# EAGLE design pong (EAGLE 4.16)
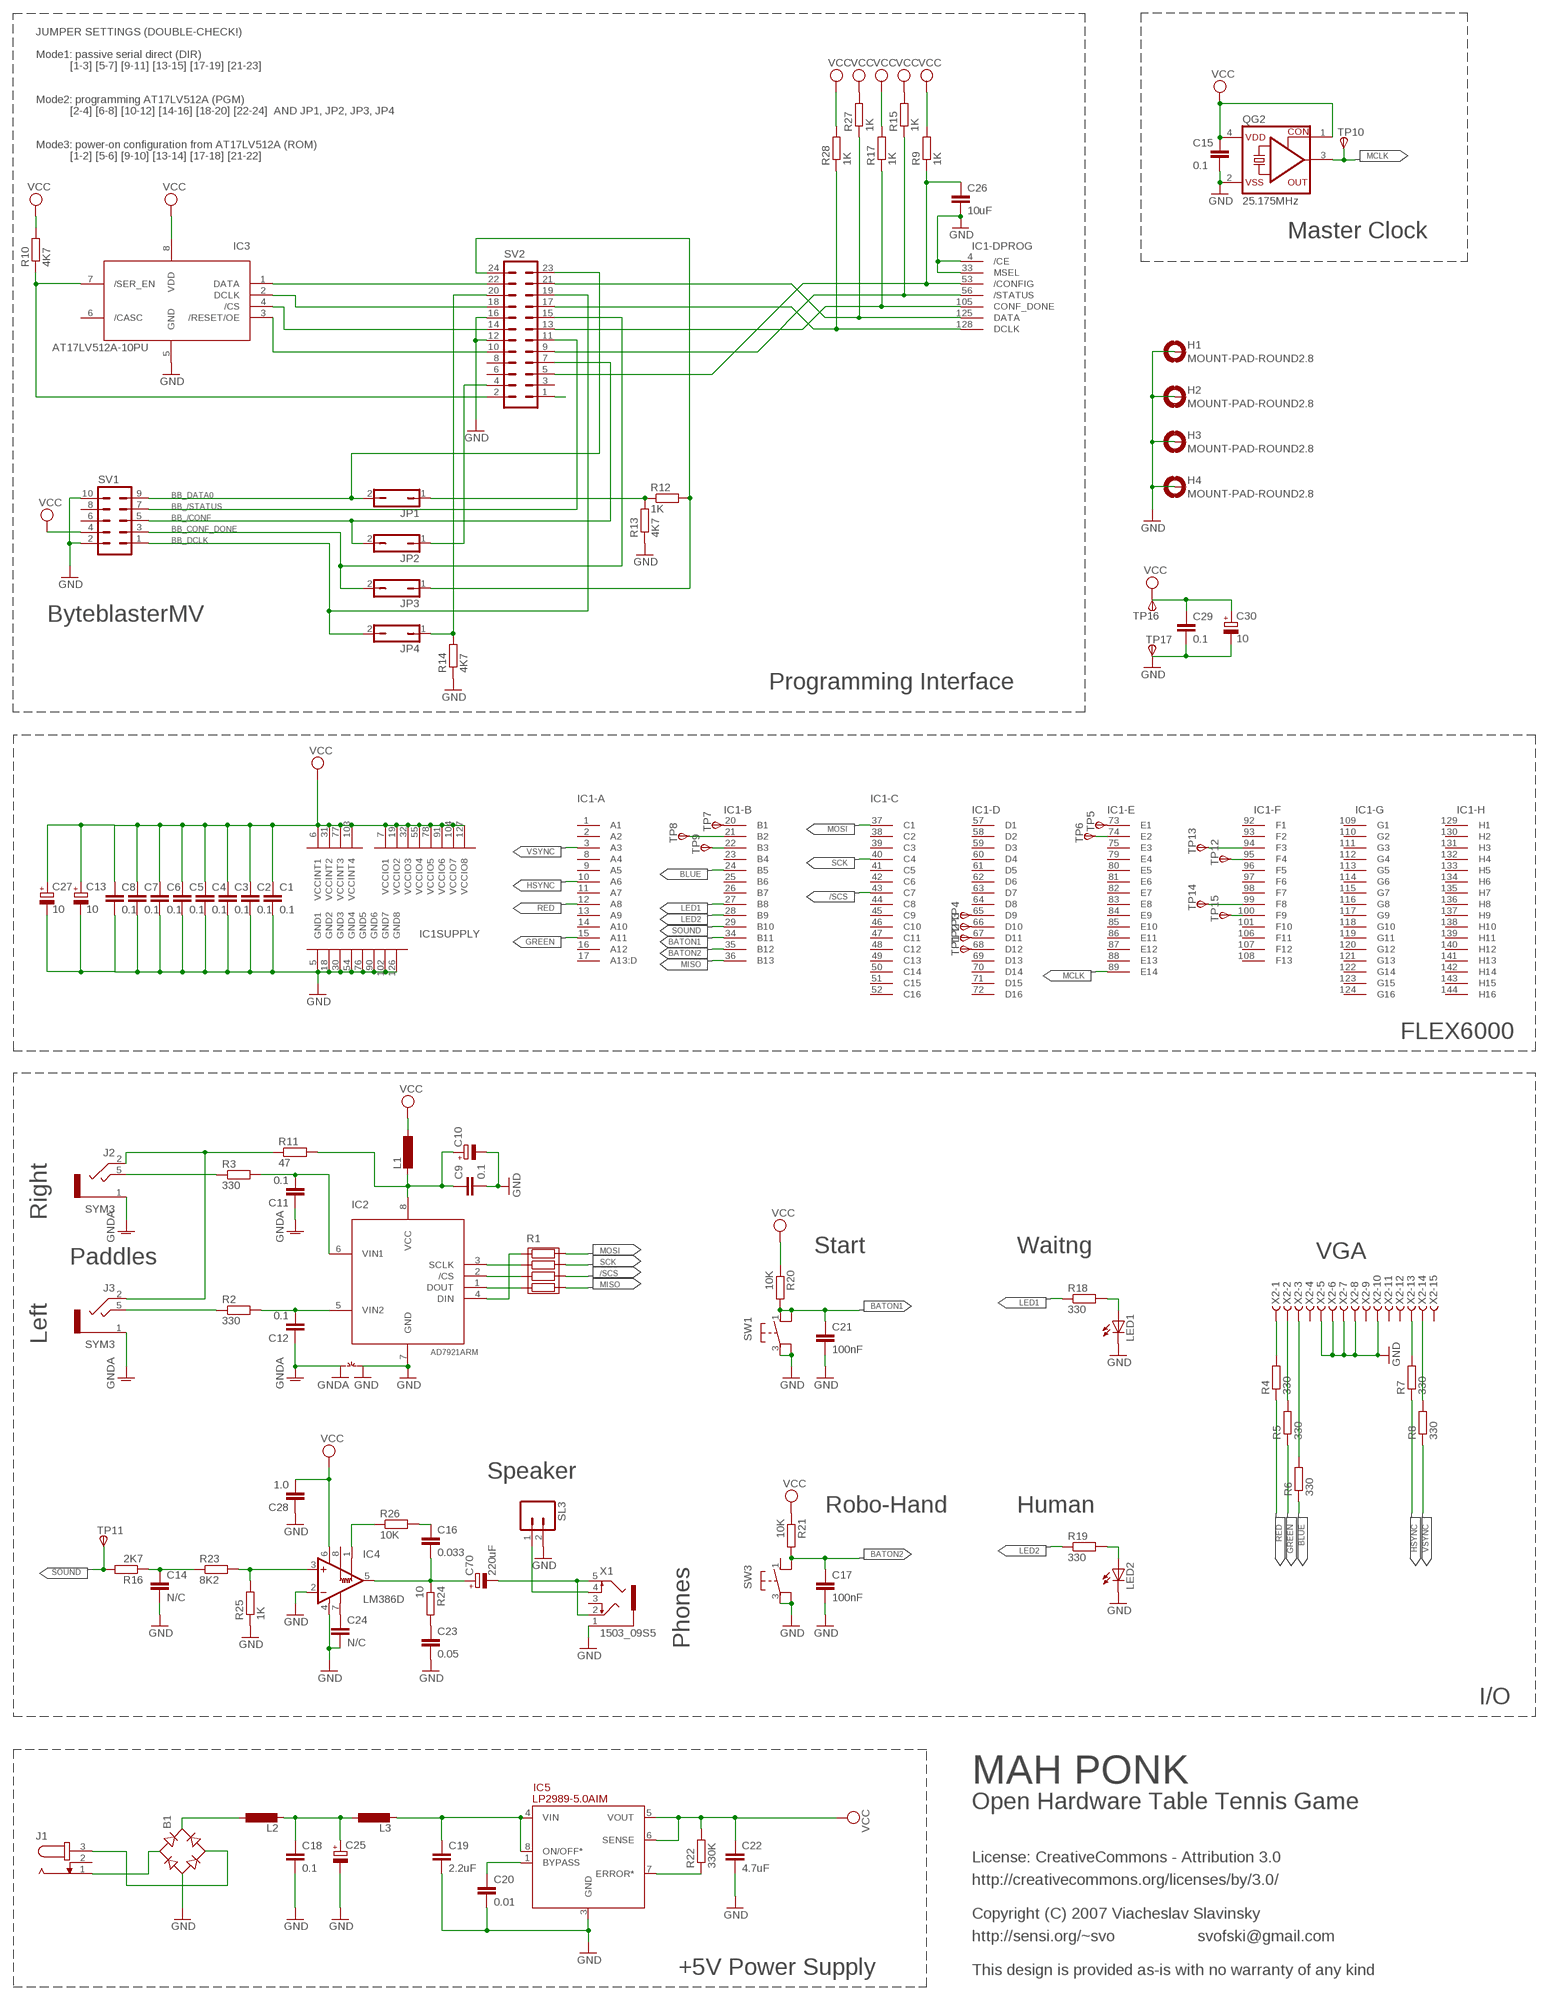
[diagram p0: schematic, sheet 1]

## Parts
B1  B-DIL  [B-DIL]
C1  0.1  C-EUC0603  [C0603]
C2  0.1  C-EUC0603  [C0603]
C3  0.1  C-EUC0603  [C0603]
C4  0.1  C-EUC0603  [C0603]
C5  0.1  C-EUC0603  [C0603]
C6  0.1  C-EUC0603  [C0603]
C7  0.1  C-EUC0603  [C0603]
C8  0.1  C-EUC0603  [C0603]
C9  0.1  C-EUC0603  [C0603]
C10  CPOL-EUB/3528-21R  [B/3528-21R]
C11  0.1  C-EUC0603  [C0603]
C12  0.1  C-EUC0603  [C0603]
C13  10  CPOL-EUB/3528-21R  [B/3528-21R]
C14  N/C  C-EUC0805S  [C0805S]
C15  0.1  C-EUC0603  [C0603]
C16  0.033  C-EUC0805S  [C0805S]
C17  100nF  C-EUC0805S  [C0805S]
C18  0.1  C-EUC0805S  [C0805S]
C19  2.2uF  C-EUC0805S  [C0805S]
C20  0.01  C-EUC0603  [C0603]
C21  100nF  C-EUC0805S  [C0805S]
C22  4.7uF  C-EUC0805S  [C0805S]
C23  0.05  C-EUC0805S  [C0805S]
C24  N/C  C-EUC0603  [C0603]
C25  CPOL-EUC  [PANASONIC_C]
C26  10uF  C-EUC0805S  [C0805S]
C27  10  CPOL-EUB/3528-21R  [B/3528-21R]
C28  1.0  C-EUC0805S  [C0805S]
C29  0.1  C-EUC0603  [C0603]
C30  10  CPOL-EUB/3528-21R  [B/3528-21R]
C70  220uF  CPOL-EUE2.5-5  [E2,5-5]
H1  MOUNT-PAD-ROUND2.8  [2,8-PAD]
H2  MOUNT-PAD-ROUND2.8  [2,8-PAD]
H3  MOUNT-PAD-ROUND2.8  [2,8-PAD]
H4  MOUNT-PAD-ROUND2.8  [2,8-PAD]
IC1  EPF6016TC144  [TQFP144]
IC2  AD7921ARM  AD7922ARM  [MSOP8]
IC3  AT17LV512A-10PU  [DIL08]
IC4  LM386D  [LINEAR_SO08]
IC5  LP2989-5.0AIM  [SO-08]
J1  JACK-PLUG0  [SPC4077]
J2  SYM3  [SYMMETRON3]
J3  SYM3  [SYMMETRON3]
JP1  JP1Q  [JP1]
JP2  JP1Q  [JP1]
JP3  JP1Q  [JP1]
JP4  JP1Q  [JP1]
L1  L-EU0805  [R0805-SVO]
L2  L-EUL5650M  [L5650M]
L3  L-EUL5650M  [L5650M]
LED1  LED3MM  [LED3MM]
LED2  LED3MM  [LED3MM]
QG2  25.175MHz  KXO-97SMD  [KXO97]
R1  RES4  [RESSMD-YC16]
R2  330  R-EU_R0805S  [R0805-SVO]
R3  330  R-EU_R0805S  [R0805-SVO]
R4  330  R-EU_R0805S  [R0805-SVO]
R5  330  R-EU_R0805S  [R0805-SVO]
R6  330  R-EU_R0805S  [R0805-SVO]
R7  330  R-EU_R0805S  [R0805-SVO]
R8  330  R-EU_R0805S  [R0805-SVO]
R9  1K  R-EU_R0805S  [R0805-SVO]
R10  4K7  R-EU_R0805S  [R0805-SVO]
R11  47  R-EU_R0805S  [R0805-SVO]
R12  1K  R-EU_R0805S  [R0805-SVO]
R13  4K7  R-EU_R0805S  [R0805-SVO]
R14  4K7  R-EU_R0805S  [R0805-SVO]
R15  1K  R-EU_R0805S  [R0805-SVO]
R16  2K7  R-EU_R0805S  [R0805-SVO]
R17  1K  R-EU_R0805S  [R0805-SVO]
R18  330  R-EU_R0805S  [R0805-SVO]
R19  330  R-EU_R0805S  [R0805-SVO]
R20  10K  R-EU_R0805S  [R0805-SVO]
R21  10K  R-EU_R0805S  [R0805-SVO]
R22  330K  R-EU_R0805S  [R0805-SVO]
R23  8K2  R-EU_R0805S  [R0805-SVO]
R24  10  R-EU_R0805S  [R0805-SVO]
R25  1K  R-EU_R0805S  [R0805-SVO]
R26  10K  R-EU_R0805S  [R0805-SVO]
R27  1K  R-EU_R0805S  [R0805-SVO]
R28  1K  R-EU_R0805S  [R0805-SVO]
SL3  M02  [02P]
SV1  ML10  [ML10]
SV2  MA12-2  [MA12-2]
SW1  BUTTON_6X6_THRU  [6X6_BUTTON_THRU]
SW3  BUTTON_6X6_THRU  [6X6_BUTTON_THRU]
TP1  TPSPAD1-13  [P1-13]
TP2  TPSPAD1-13  [P1-13]
TP3  TPSPAD1-13  [P1-13]
TP4  TPSPAD1-13  [P1-13]
TP5  TPSPAD1-13  [P1-13]
TP6  TPSPAD1-13  [P1-13]
TP7  TPSB1,27  [B1,27]
TP8  TPSB1,27  [B1,27]
TP9  TPSB1,27  [B1,27]
TP10  TPSPAD1-13  [P1-13]
TP11  TPSPAD1-13  [P1-13]
TP12  TPSB1,27  [B1,27]
TP13  TPSB1,27  [B1,27]
TP14  TPSB1,27  [B1,27]
TP15  TPSB1,27  [B1,27]
TP16  TPSPAD1-13  [P1-13]
TP17  TPSPAD1-13  [P1-13]
X1  1503_09S5  [SYMMETRON5]
X2  F15HDHS  [HDF15H]
~NUDEV~1  GND-GNDA  [GND-GNDA]

## Nets
/SCS: IC1.43(-C:C7) R1.R3$2(3.2)
ADCVCC: J2.2 J3.2 R11.1
AT17CS: IC3.4(/CS) SV2.14
AT17DATA: IC3.1(DATA) SV2.22
AT17DCLK: IC3.2(DCLK) SV2.18
AT17RESET: IC3.3(/RESET/OE) SV2.10
AT17SEREN: IC3.7(/SER_EN) R10.1 SV2.2
BATON1: C21.1 IC1.34(-B:B11) R20.2 SW1.1(P2) SW1.2
BATON2: C17.1 IC1.35(-B:B12) R21.2 SW3.2
BB_/CONF: JP2.2 SV1.5 SV2.7
BB_/STATUS: SV1.7 SV2.11
BB_CONF_DONE: JP3.2 SV1.3 SV2.15
BB_DATA0: JP1.2 SV1.9 SV2.23
BB_DCLK: JP4.2 SV1.1 SV2.19
BJB_CONF_DONE: JP3.1 R12.2 SV2.24
BJB_DATA_0: JP1.1 R12.1 R13.2
BJB_DCLK: JP4.1 R14.2 SV2.20
BJB_NCONF: JP2.1 SV2.4
BLUE: IC1.24(-B:B5) R6.1
BLUEPIN: R6.2 X2.3
CONF_DONE: IC1.105(-DPROG:CONF_DONE) R17.1 SV2.13
DATA0: IC1.125(-DPROG:DATA) R27.1 SV2.21
DCLK: IC1.128(-DPROG:DCLK) R28.1 SV2.17
GND: B1.- C1.2 C2.2 C3.2 C4.2 C5.2 C6.2 C7.2 C8.2 C9.2 C10.- C13.- C14.2 C15.2 C17.2 C18.2 C19.2 C20.2 C21.2 C22.2 C23.2 C24.2 C25.- C26.2 C27.- C28.1 C29.2 C30.- H1.B2,8(MOUNT) H2.B2,8(MOUNT) H3.B2,8(MOUNT) H4.B2,8(MOUNT) IC1.4(-DPROG:/CE) IC1.5(SUPPLY:GND1) IC1.18(SUPPLY:GND2) IC1.30(SUPPLY:GND3) IC1.33(-DPROG:MSEL) IC1.54(SUPPLY:GND4) IC1.76(SUPPLY:GND5) IC1.90(SUPPLY:GND6) IC1.102(SUPPLY:GND7) IC1.126(SUPPLY:GND8) IC2.7(GND) IC3.5(GND) IC4.2(-IN) IC4.4(GND) IC5.3(GND) LED1.K(C) LED2.K(C) QG2.2(VSS) R13.1 R14.1 R25.1 SL3.2 SV1.2 SV1.10 SV2.12 SV2.16 SW1.3(P1) SW1.4(P1) SW3.3(P1) SW3.4(P1) TP17.1(PP) X1.1 X2.5 X2.6 X2.7 X2.8 X2.10 ~NUDEV~1.GND
GNDA: C11.1 C12.1 J2.1 J3.1 ~NUDEV~1.GNDA
GREEN: IC1.15(-A:A11) R5.1
GREENPIN: R5.2 X2.2
HSYNC: IC1.10(-A:A6) R7.1
HSYNCPIN: R7.2 X2.13
LED1: IC1.27(-B:B8) R18.1
LED2: IC1.28(-B:B9) R19.1
MCLK: IC1.89(-E:E14) QG2.3(OUT) TP10.1(PP)
MISO: IC1.36(-B:B13) R1.R4$2(4.2)
MOSI: IC1.37(-C:C1) R1.R1$2(1.2)
N$1: LED1.A R18.2
N$2: IC2.1(DOUT) R1.R4$1(4.1)
N$3: IC2.2(/CS) R1.R3$1(3.1)
N$4: IC2.3(SCLK) R1.R2$1(2.1)
N$5: IC2.4(DIN) R1.R1$1(1.1)
N$6: C11.2 IC2.6(VIN1) R3.2
N$7: C12.2 IC2.5(VIN2) R2.2
N$8: J2.5 R3.1
N$9: J3.5 R2.1
N$10: IC1.95(-F:F4) TP12.PP
N$11: LED2.A R19.2
N$13: IC1.94(-F:F3) TP13.PP
N$14: IC1.99(-F:F8) TP14.PP
N$15: IC1.100(-F:F9) TP15.PP
N$16: C9.1 C10.+ IC2.8(VCC) L1.2 R11.2
N$18: C19.1 IC5.4(VIN) IC5.8(ON/OFF*) L3.2
N$20: B1.AC2 J1.3
N$21: B1.AC1 J1.1
N$22: SV2.1
N$26: B1.+ L2.1
N$29: C20.1 IC5.1(BYPASS)
N$30: IC5.7(ERROR*) R22.1
N$31: IC4.3(+IN) R23.2 R25.2
N$32: IC4.1(+GAIN) R26.1
N$33: C16.1 R26.2
N$34: C70.- X1.2 X1.5
N$35: C16.2 C70.+ IC4.5(OUT) R24.1
N$36: C23.1 R24.2
N$37: C24.1 IC4.7(BYPASS)
N$38: SL3.1 X1.4
N$39: IC1.65(-D:D9) TP4.1(PP)
N$40: IC1.66(-D:D10) TP3.1(PP)
N$41: IC1.67(-D:D11) TP2.1(PP)
N$42: IC1.68(-D:D12) TP1.1(PP)
N$43: IC1.73(-E:E1) TP5.1(PP)
N$44: IC1.74(-E:E2) TP6.1(PP)
N$45: C14.1 R16.1 R23.1
N$46: IC1.20(-B:B1) TP7.PP
N$47: IC1.21(-B:B2) TP8.PP
N$48: IC1.22(-B:B3) TP9.PP
N$49: C18.1 C25.+ L2.2 L3.1
NCONFIG: C26.1 IC1.53(-DPROG:/CONFIG) R9.1 SV2.5
NSTATUS: IC1.56(-DPROG:/STATUS) R15.1 SV2.9
RED: IC1.12(-A:A8) R4.1
REDPIN: R4.2 X2.1
SCK: IC1.40(-C:C4) R1.R2$2(2.2)
SOUND: IC1.29(-B:B10) R16.2 TP11.1(PP)
VCC: C1.1 C2.1 C3.1 C4.1 C5.1 C6.1 C7.1 C8.1 C13.+ C15.1 C22.1 C27.+ C28.2 C29.1 C30.+ IC1.6(SUPPLY:VCCINT1) IC1.7(SUPPLY:VCCIO1) IC1.19(SUPPLY:VCCIO2) IC1.31(SUPPLY:VCCINT2) IC1.32(SUPPLY:VCCIO3) IC1.55(SUPPLY:VCCIO4) IC1.77(SUPPLY:VCCINT3) IC1.78(SUPPLY:VCCIO5) IC1.91(SUPPLY:VCCIO6) IC1.103(SUPPLY:VCCINT4) IC1.104(SUPPLY:VCCIO7) IC1.127(SUPPLY:VCCIO8) IC3.8(VDD) IC4.6(V+) IC5.5(VOUT) IC5.6(SENSE) L1.1 QG2.1(CON) QG2.4(VDD) R9.2 R10.2 R15.2 R17.2 R20.1 R21.1 R22.2 R27.2 R28.2 SV1.4 TP16.1(PP)
VSYNC: IC1.3(-A:A3) R8.1
VSYNCPIN: R8.2 X2.14
Unconnected: IC1.1(-A:A1) IC1.2(-A:A2) IC1.8(-A:A4) IC1.9(-A:A5) IC1.11(-A:A7) IC1.13(-A:A9) IC1.14(-A:A10) IC1.16(-A:A12) IC1.17(-A:A13:D) IC1.23(-B:B4) IC1.25(-B:B6) IC1.26(-B:B7) IC1.38(-C:C2) IC1.39(-C:C3) IC1.41(-C:C5) IC1.42(-C:C6) IC1.44(-C:C8) IC1.45(-C:C9) IC1.46(-C:C10) IC1.47(-C:C11) IC1.48(-C:C12) IC1.49(-C:C13) IC1.50(-C:C14) IC1.51(-C:C15) IC1.52(-C:C16) IC1.57(-D:D1) IC1.58(-D:D2) IC1.59(-D:D3) IC1.60(-D:D4) IC1.61(-D:D5) IC1.62(-D:D6) IC1.63(-D:D7) IC1.64(-D:D8) IC1.69(-D:D13) IC1.70(-D:D14) IC1.71(-D:D15) IC1.72(-D:D16) IC1.75(-E:E3) IC1.79(-E:E4) IC1.80(-E:E5) IC1.81(-E:E6) IC1.82(-E:E7) IC1.83(-E:E8) IC1.84(-E:E9) IC1.85(-E:E10) IC1.86(-E:E11) IC1.87(-E:E12) IC1.88(-E:E13) IC1.92(-F:F1) IC1.93(-F:F2) IC1.96(-F:F5) IC1.97(-F:F6) IC1.98(-F:F7) IC1.101(-F:F10) IC1.106(-F:F11) IC1.107(-F:F12) IC1.108(-F:F13) IC1.109(-G:G1) IC1.110(-G:G2) IC1.111(-G:G3) IC1.112(-G:G4) IC1.113(-G:G5) IC1.114(-G:G6) IC1.115(-G:G7) IC1.116(-G:G8) IC1.117(-G:G9) IC1.118(-G:G10) IC1.119(-G:G11) IC1.120(-G:G12) IC1.121(-G:G13) IC1.122(-G:G14) IC1.123(-G:G15) IC1.124(-G:G16) IC1.129(-H:H1) IC1.130(-H:H2) IC1.131(-H:H3) IC1.132(-H:H4) IC1.133(-H:H5) IC1.134(-H:H6) IC1.135(-H:H7) IC1.136(-H:H8) IC1.137(-H:H9) IC1.138(-H:H10) IC1.139(-H:H11) IC1.140(-H:H12) IC1.141(-H:H13) IC1.142(-H:H14) IC1.143(-H:H15) IC1.144(-H:H16) IC3.6(/CASC) IC4.8(-GAIN) J1.2 SV1.6 SV1.8 SV2.3 SV2.6 SV2.8 SW3.1(P2) X1.3 X2.4 X2.9 X2.11 X2.12 X2.15

## Notes on the sheet
- JUMPER SETTINGS (DOUBLE-CHECK!)
- Mode1: passive serial direct (DIR)
- [1-3] [5-7] [9-11] [13-15] [17-19] [21-23]
- Mode2: programming AT17LV512A (PGM)
- [2-4] [6-8] [10-12] [14-16] [18-20] [22-24]  AND JP1, JP2, JP3, JP4
- Mode3: power-on configuration from AT17LV512A (ROM)
- [1-2] [5-6] [9-10] [13-14] [17-18] [21-22]
- Master Clock
- ByteblasterMV
- Programming Interface
- FLEX6000
- Right
- VGA
- Start | Waitng
- Paddles
- Left
- Speaker
- Robo-Hand | Human
- Phones
- I/O
- MAH PONK
- Open Hardware Table Tennis Game
- License: CreativeCommons - Attribution 3.0
- http://creativecommons.org/licenses/by/3.0/
- Copyright (C) 2007 Viacheslav Slavinsky
- http://sensi.org/~svo | svofski@gmail.com
- +5V Power Supply | This design is provided as-is with no warranty of any kind

## Library data of the parts
B1 = rectifier:B-DIL: RECTIFIER
C1-C9 C11 C12 C14-C24 C26 C28 C29 = rcl:C-EU: CAPACITOR, European symbol
C10 C13 C25 C27 C30 C70 = rcl:CPOL-EU: POLARIZED CAPACITOR, European symbol
H1-H4 = holes:MOUNT-PAD-ROUND: MOUNTING PAD, round
IC1 = altera:EPF6016TC144: FLEX 6000
IC2 = 0-ad7912,7922:AD7922*: Kickass 2-Channel, 2.35 V to 5.25 V, 1 MSPS, 12-Bit ADC.
IC3 = 0-at17lv:AT17LV512*: FPGA Configuration EEPROM Memory, 512Kbit
IC4 = audioamp:LM386: OP AMP
IC5 = 0-svo-lp2981:LP2989*: Micropower/Low Noise, 500mA Ultra Low-Dropout Regulator for use with Ceramic Output Capacitors
J1 = con-jack:JACK-PLUG: DC POWER JACK Power Jack, DC, Right Angle, Through Hole, Rated 5A at 16VDC, PC Terminals Distributor: Farnell (www.Farnell.de) Drawing: 84N1161.pdf / 84N1162.pdf Manufacturer: SPC Technology (www.spctechnology.com) Type: SPC4077 / SPC 4078
J2 J3 = 0-svo-jacks:SYM3
JP1-JP4 = jumper:JP1Q: JUMPER
L1-L3 = rcl:L-EU: INDUCTOR, European symbol
LED1 LED2 = 0-svo:LED: LED OSRAM: - CHIPLED LG R971, LG N971, LY N971, LG Q971, LY Q971, LO R971, LY R971 LH N974, LH R974 LS Q976, LO Q976, LY Q976 LO Q996 - Hyper CHIPLED LW Q18S LB Q993, LB Q99A, LB R99A - SideLED LS A670, LO A670, LY A670, LG A670, LP A670 LB A673, LV A673, LT A673, LW A673 LH A674 LY A675 LS A676, LA A676, LO A676, LY A676, LW A676 LS A679, LY A679, LG A679 - Hyper Micro SIDELED® LS Y876, LA Y876, LO Y876, LY Y876 LT Y87S - SmartLED LW L88C, LW L88S LB L89C, LB L89S, LG L890 LS L89K, LO L89K, LY L89K LS L896, LA L896, LO L896, LY L896 - TOPLED LS T670, LO T670, LY T670, LG T670, LP T670 LSG T670, LSP T670, LSY T670, LOP T670, LYG T670 LG T671, LOG T671, LSG T671 LB T673, LV T673, LT T673, LW T673 LH T674 LS T676, LA T676, LO T676, LY T676, LB T676, LH T676, LSB T676, LW T676 LB T67C, LV T67C, LT T67C, LS T67K, LO T67K, LY T67K, LW E67C LS E67B, LA E67B, LO E67B, LY E67B, LB E67C, LV E67C, LT E67C LW T67C LS T679, LY T679, LG T679 LS T770, LO T770, LY T770, LG T770, LP T770 LB T773, LV T773, LT T773, LW T773 LH T774 LS E675, LA E675, LY E675, LS T675 LS T776, LA T776, LO T776, LY T776, LB T776 LHGB T686 LT T68C, LB T68C - Hyper Mini TOPLED® LB M676 - Mini TOPLED Santana® LG M470 LS M47K, LO M47K, LY M47K Source: http://www.osram.convergy.de/
QG2 = 0-svo:KXO-97SMD: GEYER Clock Oscillator SMD Version, 5V 1.80 — 50.0MHz Frequency Stability: ±50ppm at -20 — + 70 °C CON pin: Active = +5V/Open
R1 = 0-svo:RES4
R2-R28 = rcl:R-EU_: RESISTOR, European symbol
SL3 = con-amp-quick:M02: AMP QUICK CONNECTOR
SV1 = con-ml:ML10: HARTING
SV2 = con-lstb:MA12-2: PIN HEADER
SW1 SW3 = 0-svo:BUTTON_6X6_*
TP1-TP17 = 0-svo:TPS: TEST PIN
X1 = 0-svo-jacks:1503_09: Jack connectors according to JISC 6560, 3.5 mm Klinkeneinbaukupplung nach JISC 6560, 3,5 mm, 3-polig/ stereo, abgewinkelte Ausführung, mit 2 Öffnern und Lötaugen, für Leiterplatten Rückseitenmontage Source: http://www.lumberg.com/Produkte/PDFs/1503_09.pdf
X2 = con-subd:F15?S: SUB-D
~NUDEV~1 = supply-dummy:GND-GNDA: Example of GND--GNDA NET-Connetor for more info read description in package

## Net classes
0 default: width 0.254 mm

## Board
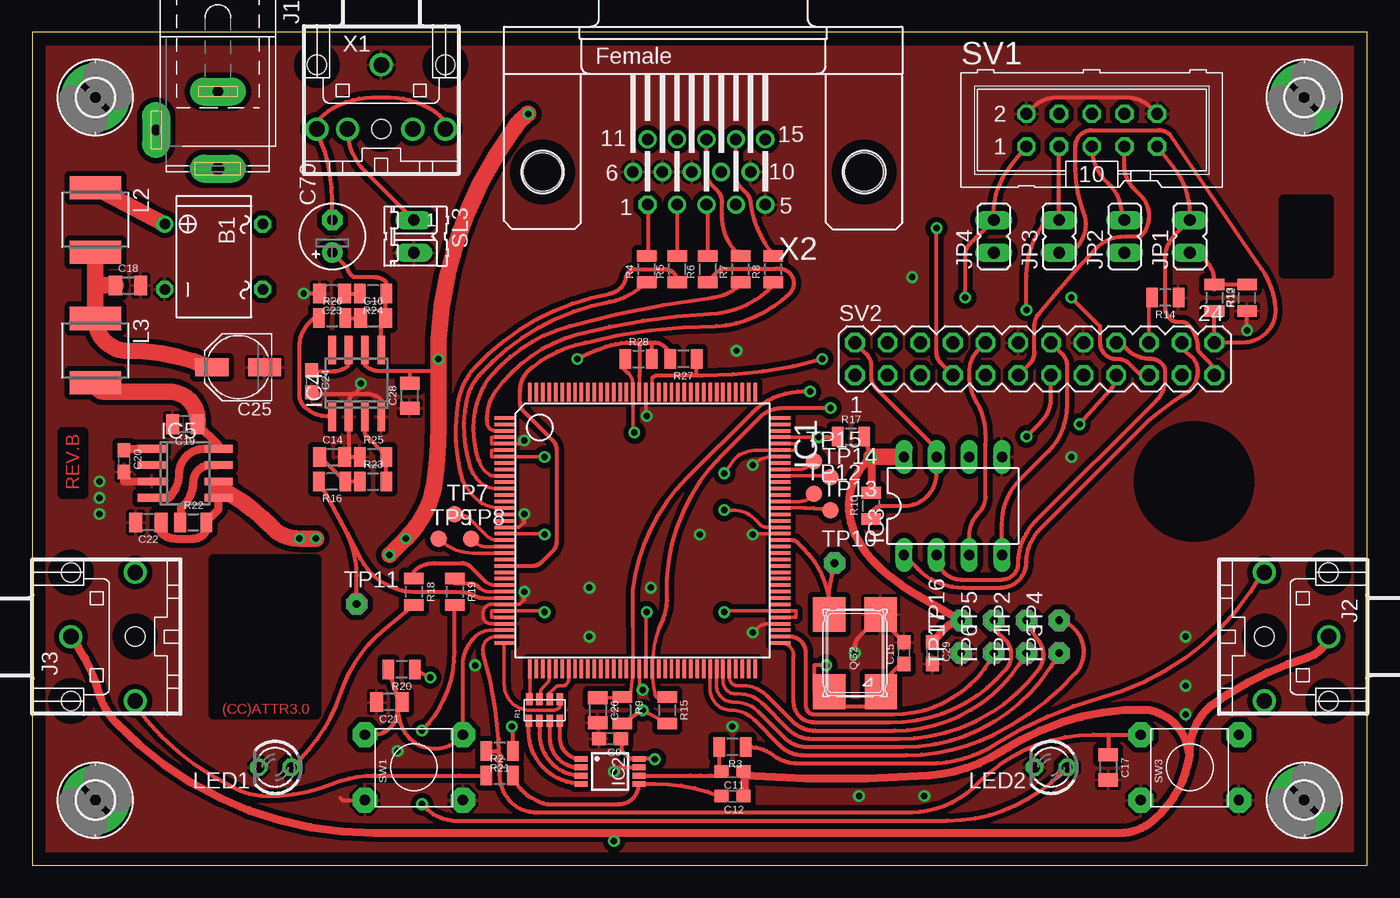
[diagram p1: board, top side]
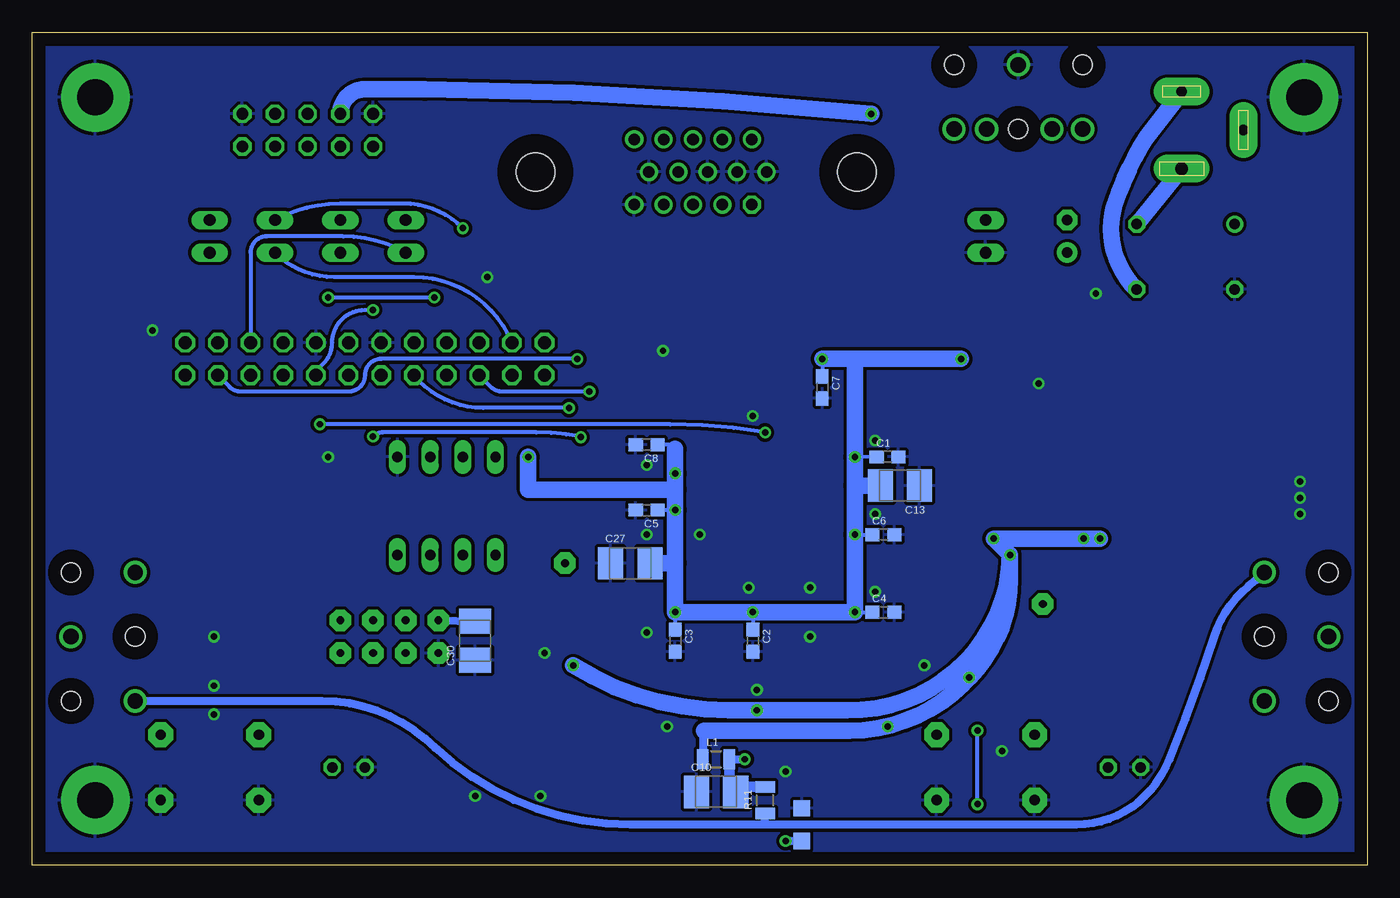
[diagram p2: board, bottom side, seen from below]

Size 103.81 x 64.76 mm. Coordinates in mm from the lower left corner, seen from the top.
Outline: 0,0 103.81,0 103.81,64.76 0,64.76 0,0
Copper layers (1*16): Top 0.035mm / dielectric 1.5mm / Bottom 0.035mm
Design rules "default": minimum track width 0.24mm, minimum drill 0.5mm, track to track 0.24mm, track to pad 0.15mm, pad to pad 0.15mm, via to via 0.24mm, smd to smd 0.15mm, copper to edge 40mil, drill to drill 8mil, minimum pad ring 10mil, minimum via ring 8mil, stop-mask expansion 1mil, vias tented up to drill 0mil, thermal gap 10mil
tRestrict: area 97.3,46 to 100.8,51.7; area 86.2,25.7 to 94.4,34; area 35.7,32.7 to 37,33.3; area 2.4,28.9 to 4,33.6; area 14.1,11.7 to 22.1,23.8

### Footprints (pad centres in the part's own frame; a part is rotated, then mirrored left to right if it is on the bottom)
B-DIL = drill 0.813 round: + -2.54,-3.81 | drill 0.813 octagon: - 2.54,-3.81; AC1 2.54,3.81; AC2 -2.54,3.81
C0603 = smd 1.1 x 1: 1 -0.85,0; 2 0.85,0
B/3528-21R = smd 1.95 x 2.5: + 1.525,0; - -1.525,0
C0805S = smd 1.016 x 1.524: 1 -0.977,0; 2 0.977,0
PANASONIC_C = smd 2.6 x 1.4: + 2.05,0; - -2.05,0
E2,5-5 = drill 0.813 pad 1.6 round: + -1.27,0 | drill 0.813 pad 1.6 octagon: - 1.27,0
2,8-PAD = drill 2.8 pad 5.334 round: B2,8 0,0
TQFP144 = smd 0.27 x 1.5: 1 -8.75,-10.75; 2 -8.25,-10.75; 3 -7.75,-10.75; 4 -7.25,-10.75; 5 -6.75,-10.75; 6 -6.25,-10.75; 7 -5.75,-10.75; 8 -5.25,-10.75; 9 -4.75,-10.75; 10 -4.25,-10.75; 11 -3.75,-10.75; 12 -3.25,-10.75; 13 -2.75,-10.75; 14 -2.25,-10.75; 15 -1.75,-10.75; 16 -1.25,-10.75; 17 -0.75,-10.75; 18 -0.25,-10.75; 19 0.25,-10.75; 20 0.75,-10.75; 21 1.25,-10.75; 22 1.75,-10.75; 23 2.25,-10.75; 24 2.75,-10.75; 25 3.25,-10.75; 26 3.75,-10.75; 27 4.25,-10.75; 28 4.75,-10.75; 29 5.25,-10.75; 30 5.75,-10.75; 31 6.25,-10.75; 32 6.75,-10.75; 33 7.25,-10.75; 34 7.75,-10.75; 35 8.25,-10.75; 36 8.75,-10.75; 73 8.75,10.75; 74 8.25,10.75; 75 7.75,10.75; 76 7.25,10.75; 77 6.75,10.75; 78 6.25,10.75; 79 5.75,10.75; 80 5.25,10.75; 81 4.75,10.75; 82 4.25,10.75; 83 3.75,10.75; 84 3.25,10.75; 85 2.75,10.75; 86 2.25,10.75; 87 1.75,10.75; 88 1.25,10.75; 89 0.75,10.75; 90 0.25,10.75; 91 -0.25,10.75; 92 -0.75,10.75; 93 -1.25,10.75; 94 -1.75,10.75; 95 -2.25,10.75; 96 -2.75,10.75; 97 -3.25,10.75; 98 -3.75,10.75; 99 -4.25,10.75; 100 -4.75,10.75; 101 -5.25,10.75; 102 -5.75,10.75; 103 -6.25,10.75; 104 -6.75,10.75; 105 -7.25,10.75; 106 -7.75,10.75; 107 -8.25,10.75; 108 -8.75,10.75 | smd 1.5 x 0.27: 37 10.75,-8.75; 38 10.75,-8.25; 39 10.75,-7.75; 40 10.75,-7.25; 41 10.75,-6.75; 42 10.75,-6.25; 43 10.75,-5.75; 44 10.75,-5.25; 45 10.75,-4.75; 46 10.75,-4.25; 47 10.75,-3.75; 48 10.75,-3.25; 49 10.75,-2.75; 50 10.75,-2.25; 51 10.75,-1.75; 52 10.75,-1.25; 53 10.75,-0.75; 54 10.75,-0.25; 55 10.75,0.25; 56 10.75,0.75; 57 10.75,1.25; 58 10.75,1.75; 59 10.75,2.25; 60 10.75,2.75; 61 10.75,3.25; 62 10.75,3.75; 63 10.75,4.25; 64 10.75,4.75; 65 10.75,5.25; 66 10.75,5.75; 67 10.75,6.25; 68 10.75,6.75; 69 10.75,7.25; 70 10.75,7.75; 71 10.75,8.25; 72 10.75,8.75; 109 -10.75,8.75; 110 -10.75,8.25; 111 -10.75,7.75; 112 -10.75,7.25; 113 -10.75,6.75; 114 -10.75,6.25; 115 -10.75,5.75; 116 -10.75,5.25; 117 -10.75,4.75; 118 -10.75,4.25; 119 -10.75,3.75; 120 -10.75,3.25; 121 -10.75,2.75; 122 -10.75,2.25; 123 -10.75,1.75; 124 -10.75,1.25; 125 -10.75,0.75; 126 -10.75,0.25; 127 -10.75,-0.25; 128 -10.75,-0.75; 129 -10.75,-1.25; 130 -10.75,-1.75; 131 -10.75,-2.25; 132 -10.75,-2.75; 133 -10.75,-3.25; 134 -10.75,-3.75; 135 -10.75,-4.25; 136 -10.75,-4.75; 137 -10.75,-5.25; 138 -10.75,-5.75; 139 -10.75,-6.25; 140 -10.75,-6.75; 141 -10.75,-7.25; 142 -10.75,-7.75; 143 -10.75,-8.25; 144 -10.75,-8.75
MSOP8 = smd 0.45 x 1: 1 -0.975,-2.25; 2 -0.325,-2.25; 3 0.325,-2.25; 4 0.975,-2.25; 5 0.975,2.25; 6 0.325,2.25; 7 -0.325,2.25; 8 -0.975,2.25
DIL08 = drill 0.813 long: 1 -3.81,-3.81; 2 -1.27,-3.81; 3 1.27,-3.81; 4 3.81,-3.81; 5 3.81,3.81; 6 1.27,3.81; 7 -1.27,3.81; 8 -3.81,3.81
LINEAR_SO08 = smd 0.6 x 2.2: 1 -1.905,-2.6; 2 -0.635,-2.6; 3 0.635,-2.6; 4 1.905,-2.6; 5 1.905,2.6; 6 0.635,2.6; 7 -0.635,2.6; 8 -1.905,2.6
SO-08 = smd 0.6 x 2.2: 1 -1.905,-2.6; 2 -0.635,-2.6; 3 0.635,-2.6; 4 1.905,-2.6; 5 1.905,2.6; 6 0.635,2.6; 7 -0.635,2.6; 8 -1.905,2.6
SPC4077 = drill 0.8 pad 2.184 long: 1 -3,0; 2 0,-4.8 | drill 1 pad 2.184 long: 3 3,0
SYMMETRON3 = drill 1.2 round: 1 0,0; 2 5,5; 5 5,-5 | hole 1.5: 0,-5; 5,0; 0,5
JP1 = drill 0.914 long: 1 0,-1.27; 2 0,1.27
R0805-SVO = smd 0.9 x 1.524: 1 -1.027,0; 2 1.027,0
L5650M = smd 1.8 x 4: 1 -2.5,0; 2 2.5,0
LED3MM = drill 0.813 octagon: A -1.27,0; K 1.27,0
KXO97 = smd 2.7 x 2.5: 1 -3.01,-2.01; 2 3,-2; 3 3,2; 4 -3,2
RESSMD-YC16 = smd 0.508 x 0.914: R1$1 -1.23,-0.821; R1$2 -1.2,0.851; R2$1 -0.4,-0.821; R2$2 -0.4,0.851; R3$1 0.4,-0.821; R3$2 0.4,0.851; R4$1 1.2,-0.821; R4$2 1.2,0.851
02P = drill 0.914 long: 1 -1.27,0; 2 1.27,0
ML10 = drill 0.914 octagon: 1 -5.08,-1.27; 2 -5.08,1.27; 3 -2.54,-1.27; 4 -2.54,1.27; 5 0,-1.27; 6 0,1.27; 7 2.54,-1.27; 8 2.54,1.27; 9 5.08,-1.27; 10 5.08,1.27
MA12-2 = drill 1.016 octagon: 1 -13.97,-1.27; 2 -13.97,1.27; 3 -11.43,-1.27; 4 -11.43,1.27; 5 -8.89,-1.27; 6 -8.89,1.27; 7 -6.35,-1.27; 8 -6.35,1.27; 9 -3.81,-1.27; 10 -3.81,1.27; 11 -1.27,-1.27; 12 -1.27,1.27; 13 1.27,-1.27; 14 1.27,1.27; 15 3.81,-1.27; 16 3.81,1.27; 17 6.35,-1.27; 18 6.35,1.27; 19 8.89,-1.27; 20 8.89,1.27; 21 11.43,-1.27; 22 11.43,1.27; 23 13.97,-1.27; 24 13.97,1.27
6X6_BUTTON_THRU = drill 0.813 pad 1.93 octagon: 1 -2.54,3.81; 2 -2.54,-3.81; 3 2.54,-3.81; 4 2.54,3.81
P1-13 = drill 0.61 pad 1.676 octagon: 1 0,0
B1,27 = smd 1.27 x 1.27: PP 0,0
SYMMETRON5 = drill 1.2 round: 1 -2.54,0; 2 2.46,5; 3 2.46,2.46; 4 2.46,-2.62; 5 2.46,-5 | hole 1.5: -2.54,-5; 2.46,0; -2.54,5
HDF15H = drill 0.9 octagon: 1 4.329,2.54 | drill 0.9 round: 2 2.043,2.54; 3 -0.243,2.54; 4 -2.529,2.54; 5 -4.815,2.54; 6 5.472,0; 7 3.186,0; 8 0.9,0; 9 -1.386,0; 10 -3.672,0; 11 4.329,-2.54; 12 2.043,-2.54; 13 -0.243,-2.54; 14 -2.529,-2.54; 15 -4.815,-2.54 | hole 3: -12.5,0; 12.5,0
GND-GNDA = smd 1.27 x 1.27: GND -1.27,0; GNDA 1.27,0

### Placement (x,y rotation side)
B1  14.12,47.3 270 top
C1  37.3,31.75 0 bottom
C2  47.78,17.46 270 bottom
C3  53.81,17.46 270 bottom
C4  37.62,19.68 0 bottom
C5  56.03,27.62 180 bottom
C6  37.62,25.71 0 bottom
C7  42.38,37.14 270 bottom
C8  56.03,32.7 180 bottom
C9  44.92,9.84 180 top
C10  50.63,5.71 0 bottom
C11  54.45,7.3 180 top
C12  54.45,5.39 180 top
C13  36.35,29.52 180 bottom
C14  23.33,31.75 0 top
C15  67.78,16.5 90 top
C16  26.51,42.54 0 top
C17  83.65,7.61 270 top
C18  7.46,45.08 0 top
C19  11.9,34.29 180 top
C20  7.14,31.43 270 top
C21  27.78,12.7 180 top
C22  9.04,26.66 180 top
C23  23.33,44.45 180 top
C24  21.74,37.62 270 top
C25  16.03,38.73 180 top
C26  43.97,12.06 270 top
C27  57.3,23.49 0 bottom
C28  29.36,36.51 90 top
C29  70,16.5 270 top
C30  69.37,17.46 90 bottom
C70  23.33,48.89 90 top
H1  98.89,59.69 0 top
H2  98.89,5.08 0 top
H3  4.92,5.08 0 top
H4  4.92,59.69 0 top
IC1  47.46,26.03 270 top
IC2  44.92,7.3 270 top
IC3  71.59,27.94 0 top
IC4  25.23,37.46 0 top
IC5  11.9,30.48 270 top
J1  14.44,57.15 270 top
J2  100.8,17.78 180 top
J3  3.01,17.78 0 top
JP1  90,48.89 0 top
JP2  84.92,48.89 0 top
JP3  79.84,48.89 0 top
JP4  74.77,48.89 0 top
L1  50.63,8.25 0 bottom
L2  4.92,50.16 270 top
L3  4.92,40 270 top
LED1  18.89,7.61 180 top
LED2  79.21,7.61 180 top
QG2  63.97,16.5 90 top
R1  39.84,12.06 0 top
R2  36.35,6.98 0 top
R3  54.45,9.2 180 top
R4  47.78,46.35 90 top
R5  50.16,46.35 90 top
R6  52.54,46.35 90 top
R7  55.08,46.35 90 top
R8  57.62,46.35 90 top
R9  45.87,12.06 270 top
R10  65.24,27.94 90 top
R11  46.83,5.08 90 bottom
R12  91.91,44.13 270 top
R13  94.45,44.13 90 top
R14  88.1,44.13 180 top
R15  49.37,12.06 270 top
R16  23.33,29.84 180 top
R17  63.65,33.33 0 top
R18  29.68,21.27 270 top
R19  32.86,21.27 270 top
R20  28.73,15.24 180 top
R21  36.35,8.88 180 top
R22  12.54,26.66 0 top
R23  26.51,29.84 0 top
R24  26.51,44.45 180 top
R25  26.51,31.75 0 top
R26  23.33,42.54 0 top
R27  50.63,39.37 180 top
R28  47.14,39.37 0 top
SL3  29.68,48.89 270 top
SV1  82.38,57.15 0 top
SV2  77.94,39.37 0 top
SW1  29.68,7.61 270 top
SW3  90,7.61 270 top
TP1  77.3,16.5 90 top
TP2  77.3,19.05 90 top
TP3  79.84,16.5 90 top
TP4  79.84,19.05 90 top
TP5  74.77,19.05 90 top
TP6  74.77,16.5 90 top
TP7  32.86,27.3 0 top
TP8  34.12,25.39 0 top
TP9  31.59,25.39 0 top
TP10  62.38,23.49 0 top
TP11  25.23,20.32 0 top
TP12  60.8,28.89 0 top
TP13  62.06,27.62 0 top
TP14  62.06,30.16 0 top
TP15  60.8,31.43 0 top
TP16  72.22,19.05 90 top
TP17  72.22,16.5 90 top
X1  27.14,59.69 270 top
X2  52.18,53.89 180 top
~NUDEV~1  43.97,3.17 270 bottom

### Tracks (layer width: path | path; a pad name or v marks a point on that pad's centre or on a via)
/SCS
  Top 0.254: IC1.43 41.71,14.51 arc-45 41.52,14.06 arc-45 41.29,13.96 41.06,13.96 arc45 40.61,13.78 40.16,13.33 40.24,13.25 R1.R3$2
ADCVCC
  Bottom 0.61: 46.83,3.17 22.63,3.17 arc-45 17.32,5.37 arc-22 15.39,8.25 arc-5 11.9,17.78 arc42 8.09,22.54 J3.2 | J2.2 81.29,12.78 arc45 72.45,9.11 72.54,9.2 arc-43 57.3,3.17 46.83,3.17 | 46.83,3.17 R11.1
AT17CS
  Top 0.305: SV2.14 80.11,39.74 arc-45 80.48,38.84 80.48,35.72 arc-45 79.02,32.19 76.86,30.04 arc45 75.4,26.5 IC3.4
AT17DATA
  Top 0.305: 90.14,39.55 arc-45 SV2.22 | IC3.1 68.85,23.05 arc45 72.39,21.59 75.3,21.59 arc90 77.3,23.59 arc-45 78.36,26.13 86.83,34.6 arc-8 89.37,36.51 arc67 90.64,38.41 arc45 90.19,39.5 90.14,39.55 | 90.14,39.55 90,39.68
AT17DCLK
  Top 0.254: 87.43,36.16 87.46,36.19
  Top 0.305: SV2.18 84.61,40.63 85.13,40.11 arc45 86.93,39.37 arc-45 87.84,38.99 arc-45 88.1,38.37 88.1,37.77 arc-45 87.43,36.16 78.02,26.74 arc45 76.67,23.49 arc-90 75.4,22.22 72.22,22.22 arc-90 IC3.2
AT17RESET
  Top 0.305: SV2.10 73.6,40.11 arc45 72.86,38.31 72.86,38.2 arc30 73.49,35.87 arc-29 74.13,33.65 arc-3 74.13,32.7 74.13,28.68 arc-45 73.6,27.41 arc45 72.86,25.61 IC3.3
AT17SEREN
  Top 0.305: SV2.2 64.87,39.74 arc-45 65.24,38.84 65.24,37.99 arc45 65.61,37.09 70.32,32.38 IC3.7 70.32,30.48 arc-90 67.78,27.94 66.08,27.94 arc97 65.24,26.98 R10.1
BATON1
  Top 0.254: IC1.34 35.66,18.28 arc45 34.44,17.78
  Top 0.305: C21.1 28.41,13.01 R20.2 | C21.1 arc90 28.41,12.99 28.41,12.38 | 28.41,12.38 arc23 28.73,10.79 arc120 SW1.1 33.49,15.87 arc-37 34.44,17.78 | SW1.2 26.51,10.16 arc90 28.41,12.06 28.41,12.38 | 28.41,12.38 C21.1
BATON2
  Top 0.254: 35.08,16.5 arc-106 36.03,17.78 arc0 36.66,17.78 IC1.35
  Top 0.305: 83.65,8.57 C17.1 83.65,10.16 | 85.56,10.16 85.24,10.16 | 85.56,10.16 SW3.2 | 83.65,10.16 82.48,10.16 arc45 73.64,6.49 arc-45 68.37,4.12 39.2,4.12 arc-90 36.35,6.98 | 83.65,10.16 85.56,10.16 | 36.35,6.98 36.35,7.53 arc16 35.08,16.5 | R21.2 36.03,8.88 arc-90 36.35,8.57 36.35,6.98
BB_/CONF  (via drill 0.5)
  Top 0.305: SV2.7 70.69,38.99 arc-45 70.32,39.89 v70.32,49.52 | JP2.2 84.61,51.43 arc34 83.65,53.02 arc-48 SV1.5
  Bottom 0.305: v70.32,49.52 arc-45 74.92,51.43 79.84,51.43 arc-28 JP2.2
BB_/STATUS
  Top 0.305: SV1.7 84.92,54.39 arc45 85.67,52.59 86.19,52.06 arc-90 86.19,48.89 84.92,48.89 arc46 82.7,47.94 arc5 78.26,42.86 78.31,42.91 arc45 77.94,42.01 77.94,39.89 arc-45 77.57,38.99 SV2.11
BB_CONF_DONE  (via drill 0.5)
  Top 0.305: SV1.3 JP3.2 arc100 78.89,50.16 arc40 77.3,45.82 v77.3,43.17
  Bottom 0.305: SV2.15 81.75,38.41 81.15,39.01 arc-45 80.48,40.63 arc90 77.94,43.17 v77.3,43.17
BB_DATA0
  Top 0.305: SV2.23 arc45 91.46,39.18 90.79,39.85 arc-45 90.64,40.22 arc45 89.9,42.01 arc45 89.39,42.22 89.05,42.22 arc-45 88.51,42.45 88.42,42.54 arc-45 88.1,43.31 88.1,47.2 arc-45 88.84,49 JP1.2 arc43 88.73,54.29 SV1.9
BB_DCLK  (via drill 0.5)
  Top 0.305: SV2.19 86.19,38.09 85.3,38.99 arc45 84.4,39.37 84.29,39.37 arc-90 83.02,40.63 83.02,41.91 v80.8,44.13 | v72.54,44.13 72.54,47.41 arc-45 72.91,48.31 JP4.2 arc-43 76.03,54.29 SV1.1
  Bottom 0.305: v72.54,44.13 v80.8,44.13
BJB_CONF_DONE
  Top 0.254: 88.47,56.77 88.42,56.83
  Top 0.305: R12.2 SV2.24 94.13,40.63 arc90 96.67,43.17 arc34 95.22,46.85 88.42,56.83 | 88.47,56.77 arc45 87.57,57.15 82.38,57.15 arc90 81.11,55.88 81.11,54.18 arc21 81.75,50.8 arc-68 81.11,47.94 arc-59 JP3.1
BJB_DATA_0
  Top 0.305: JP1.1 90.11,47.62 arc-45 91.01,47.25 91.17,47.09 arc-45 91.91,45.3 R12.1 91.91,44.76 91.98,45.15 R13.2
BJB_DCLK
  Top 0.254: R14.2 87.15,43.81 86.83,43.49 SV2.20
  Bottom 0.305: SV2.20 86.83,47.62 arc90 85.56,48.89 79.63,48.89 arc29 JP4.1
BJB_NCONF
  Bottom 0.305: JP2.1 arc-45 80.33,45.72 74.13,45.72 arc67 SV2.4
BLUE
  Top 0.305: IC1.24 38.9,23.28 arc45 39.61,23.57 40.5,24.47 arc45 40.79,25.17 40.79,32.28 arc45 40.5,32.99 38.23,35.26 arc-45 37.94,35.97 37.94,36.83 arc-53 38.89,38.73 arc-28 43.02,40.63 arc-14 53.18,41.91 arc40 58.89,44.45 arc129 58.26,46.35 arc16 57.62,46.35 53.91,46.35 | R6.1 52.54,45.4 53.2,46.06 arc-45 53.91,46.35 | 53.91,46.35 53.81,46.35
BLUEPIN
  Top 0.305: X2.3 52.43,51.32 52.38,51.27 52.54,51.11 R6.2
CONF_DONE  (via drill 0.5)
  Top 0.254: IC1.105 v61.16,33.28
  Top 0.305: v77.3,33.33 78.47,34.49 arc45 79.21,36.29 SV2.13 | v61.16,33.28 61.11,33.33 R17.1
  Bottom 0.305: v77.3,33.33 arc45 76.54,33.65 64.6,33.65 arc10 61.11,33.33 v61.16,33.28
DATA0  (via drill 0.5)
  Top 0.254: IC1.125 48.21,37.89 | 51.59,38.09 51.66,38.17
  Top 0.305: 48.21,37.89 arc-45 48.7,38.09 51.59,38.09 52.13,38.09 arc16 v61.43,39.37 | 51.66,38.17 R27.1
  Bottom 0.305: v61.43,39.37 76.67,39.37 arc-90 77.94,38.09 arc90 79.21,36.83 87.57,36.83 arc45 88.47,37.2 SV2.21
DCLK  (via drill 0.5)
  Top 0.254: 46.71,33.77 IC1.128 46.71,37.37 arc45 46.34,38.26 | R28.1 45.87,39.37 45.87,38.73
  Top 0.305: v81.43,34.29 83.86,36.99 arc42 SV2.17 | v46.83,33.65 46.71,33.77 | 46.34,38.26 45.87,38.73
  Bottom 0.305: v81.43,34.29 54.18,34.29 arc10 v46.83,33.65
GND  (via drill 0.5)
  Top 0.254: IC1.90 56.1,25.78 | IC1.126 47.71,34.99 | 38.34,32.78 IC1.5 35.71,32.78 35.71,33.28 IC1.4 | IC1.18 37.87,26.28 38.25,26.66 | 38.25,20.63 37.9,20.28 IC1.30 35.68,20.28 arc90 35.08,19.68 35.08,19.36 arc90 35.66,18.78 IC1.33 | v56.03,18.09 56.35,18.41 arc-45 57.25,18.78 IC1.76 | v56.03,31.11 arc-45 57.65,31.78 IC1.102 | IC1.54 47.21,14.25 arc45 v47.46,13.65 47.55,13.55
  Top 0.305: 56.1,25.78 v56.03,25.71 | SV1.2 77.83,58.94 arc-45 79.63,59.69 85.14,59.69 arc-45 86.94,58.94 SV1.10 | 47.71,34.99 v47.78,34.92 | 38.34,32.78 v38.25,33.02 | 38.25,26.66 v38.25,27.3 | 38.25,20.63 v38.25,21.27 | v94.45,41.59 R13.1 | 65.88,19.6 65.88,19.68 | 65.88,19.6 QG2.2 | 65.88,19.26 C15.2 | 65.88,19.26 65.88,19.6 | 65.88,19.26 65.77,19.26 64.34,17.83 arc45 63.97,16.93 v63.97,16.5 | 24.92,36.67 arc45 24.6,35.9 IC4.2 24.6,31.75 | 24.92,36.67 25.23,36.67 | 25.23,36.67 25.99,36.67 arc-45 27.14,36.19 27.14,34.92 27.2,34.86 | 27.2,34.86 27.3,34.76 | 27.2,34.86 IC4.4 | 24.6,31.75 C14.2 | 24.6,31.75 R25.1 | C24.2 22,36.77 22.06,36.83 22.22,36.67 24.92,36.67 | 25.23,36.67 25.23,36.83 25.33,36.92 arc45 v25.55,37.46 | C23.2 v21.11,44.45 | SW1.3 24.12,5.08 23.97,5.23 | IC2.7 45.56,7.62 v45.24,7.3
  Top 0.61: C19.2 10.95,34.29 11.05,34.39 | 7.14,30.32 | 7.14,30.32 C20.2 7.14,30.48 | IC5.3 7.14,29.84 7.14,30.48 | 7.14,30.48
  other vias: 54.76,40 43.33,17.78 51.91,25.71 43.33,21.59 28.41,8.88 89.69,17.78 80.8,31.75 34.44,15.55 48.09,21.59 69.37,5.39 64.29,5.39 5.23,29.84 5.23,28.57 5.23,27.3 54.45,10.79 68.41,45.72 89.69,11.74 89.69,13.96
  pour Bottom (isolate 0.254, rank 3): 0.47,64.13 0.47,-0.01 103.34,-0.01 103.34,64.13
  pour Top (isolate 0.406, rank 3): 0.15,64.13 103.66,64.13 103.66,0.31 0.15,0.31
GNDA  (via drill 0.5)
  Top 0.61: 45.24,2.54 26.6,2.54 arc-46 6.5,11.11 arc-28 5.23,13.33 arc22 J3.1 | 45.24,2.54 84.62,2.54 arc45 87.31,3.65 arc41 90,8.57 | 90,8.57 arc-49 91.59,12.38 arc-19 99.21,16.19 arc56 J2.1 | 90,8.57 arc40 88.73,11.11 arc32 86.83,12.06 84.92,12.06 arc29 75.4,8.88 arc-29 69.68,6.98 arc-8 55.4,6.98 | 45.24,2.54 v45.24,1.9 | 55.4,6.98 C11.1 | C12.1 55.4,6.03 55.4,6.98
  Bottom 0.61: v45.24,1.9 ~NUDEV~1.GNDA
GREEN
  Top 0.254: IC1.15 36.29,27.78 arc-45 34.49,28.52 34.44,28.57 arc-16 33.49,29.84
  Top 0.305: R5.1 50.16,45.35 arc90 49.16,46.35 46.83,46.35 arc70 46.19,45.72 arc-70 44.92,44.45 arc37 34.44,38.73 arc33 33.17,36.19 arc26 33.49,29.84
GREENPIN
  Top 0.305: X2.2 50.14,51.29 50.16,51.27 R5.2
HSYNC
  Top 0.254: IC1.10 35.87,30.28 arc-45 35.4,30.48 arc-35 34.76,31.43
  Top 0.305: R7.1 55.24,45.24 arc-36 52.86,44.13 arc9 41.74,41.91 arc33 35.71,38.09 arc15 35.08,37.14 arc46 34.76,31.43
HSYNCPIN
  Top 0.305: X2.13 52.43,53.81 arc45 52.8,52.92 53.28,52.44 arc-45 53.65,51.54 53.65,50.64 arc46 54.73,47.68 55.08,47.68 R7.2 55.08,47.3
LED1
  Top 0.254: 35.23,22.07 arc45 35.93,21.78 IC1.27
  Top 0.305: 35.23,22.07 34.1,23.2 arc45 33.39,23.49 31.21,23.49 arc45 29.68,22.86 R18.1
LED2
  Top 0.254: 34.77,21.57 arc45 35.48,21.28 IC1.28
  Top 0.305: R19.1 32.86,21.9 34.03,21.9 arc-45 34.73,21.61 34.77,21.57
MCLK
  Top 0.254: 59.06,25.28 IC1.89
  Top 0.305: QG2.3 62.06,19.6 arc45 59.99,24.62 59.51,25.09 arc45 59.06,25.28 | QG2.3 62.05,19.54 | TP10.1 62.06,21.9 arc23 62.06,19.36 QG2.3
MISO
  Top 0.254: R1.R4$2 41.04,12.31 arc-45 40.44,12.06 38.71,12.06 arc-90 36.71,14.06 IC1.36
MOSI
  Top 0.254: R1.R1$2 38.64,12.94 38.57,13.01 38.71,13.15 IC1.37
N$1
  Top 0.305: R18.2 27.46,18.41 arc32 23.96,13.33 arc-30 LED1.A
N$2
  Top 0.305: IC2.1 42.7,8.25 arc-90 41.04,9.91 R1.R4$1
N$3
  Top 0.305: IC2.2 42.39,7.62 42.38,7.61 arc-90 40.24,10.07 R1.R3$1
N$4
  Top 0.254: IC2.3 42.69,6.97 arc90 42.7,6.98
  Top 0.305: R1.R2$1 39.44,10.24 arc90 42.7,6.98
N$5
  Top 0.254: IC2.4 IC2.4 arc90 42.7,6.34
  Top 0.305: R1.R1$1 38.61,10.43 arc90 42.7,6.34
N$6
  Top 0.305: IC2.6 51.18,6.97 arc0 53.49,6.98 C11.2 53.49,7.3 R3.2
N$7
  Top 0.305: R2.2 37.3,6.98 arc55 40.05,4.76 45.61,4.76 arc90 IC2.5 47.14,6.34 48.41,6.34 arc-21 53.49,5.39 C12.2
N$8
  Top 0.305: J2.5 95.72,22.86 arc-46 83.02,13.01 arc18 75.08,9.52 arc-12 73.18,8.57 arc-21 69.68,7.93 59.52,7.93 arc-37 57.62,8.57 arc42 55.4,9.2 R3.1
N$9
  Top 0.305: 33.17,6.98 26.6,6.98 arc22 23.33,6.34 arc-23 18.25,5.39 arc-27 15.71,6.03 arc-29 7.77,12.7 J3.5 | 33.17,6.98 33.24,6.98 | 33.17,6.98 R2.1
N$10
  Top 0.254: IC1.95 59.66,28.28 arc45 60.56,28.65 TP12.PP
N$11  (via drill 0.5)
  Top 0.305: v30.32,10.47 arc45 32.86,16.61 R19.2 | v30.32,4.76 arc45 32.61,3.49 71.17,3.49 arc45 80.01,7.15 LED2.A
  Bottom 0.305: v30.32,4.76 v30.32,10.47
N$13
  Top 0.254: IC1.94 60.09,27.78
  Top 0.305: 60.09,27.78 arc-9 TP13.PP
N$14
  Top 0.254: IC1.99 61.77,30.28 arc-45 TP14.PP
N$15
  Top 0.254: IC1.100 59.62,30.78 arc45 60.52,31.15 TP15.PP
N$16  (via drill 0.5)
  Top 0.305: C9.1 45.87,9.84 45.87,8.88 46.48,8.27 IC2.8 48.39,8.27 v48.41,8.25
  Bottom 0.61: L1.2 v48.41,8.25
  Bottom 0.813: R11.2 48.73,6.1 | 48.73,6.1 48.78,6.1 arc45 49.37,6.34 arc45 49.61,6.93 L1.2 | 48.73,6.1 48.73,6.03 49,5.75 arc45 C10.+
N$18
  Top 0.61: 12.75,34.23 12.85,34.13 12.88,34.15 C19.1 12.88,34.26 14.5,32.64 IC5.8 13.39,32.38 arc90 11.42,30.42 arc-45 10.68,28.62 10.63,28.57 IC5.4
  Top 1.27: C19.1 12.88,34.58 12.85,34.6 arc90 10.63,36.83 5.59,36.83 arc-90 L3.2
N$20
  Bottom 1.27: J1.3 B1.AC2
N$21
  Bottom 1.27: J1.1 16.98,56.83 arc-7 17.62,55.88 arc-7 18.89,53.34 arc-3 19.52,51.75 arc-66 B1.AC1
N$26
  Top 1.27: L2.1 B1.+
N$29
  Top 0.61: 7.14,32.38 | C20.1 7.14,32.38 | 7.14,32.38 IC5.1
N$30
  Top 0.61: 11.58,26.66 R22.1 11.51,26.75 11.58,26.82 11.58,27.78 11.79,27.98 arc45 12.54,29.78 arc-90 13.86,31.11 IC5.7
N$31
  Top 0.305: R23.2 27.53,31.51 27.46,31.59 27.53,31.66 R25.2 27.53,31.83 25.87,33.49 IC4.3
N$32
  Top 0.305: R26.1 21.9,42.54 21.53,42.17 arc45 20.79,40.38 20.79,36.55 arc45 21.16,35.66 arc45 22.95,34.92 23.49,34.92 23.43,34.86 IC4.1
N$33
  Top 0.305: R26.2 C16.1
N$34
  Top 0.305: X1.2 32.14,57.86 32.07,57.93 arc45 27.83,59.69 26.45,59.69 arc45 22.21,57.93 22.06,57.78 22.06,57.15 | C70.- 23.33,51.75 arc26 22.06,57.15 | 22.06,57.15 X1.5
N$35
  Top 0.305: IC4.5 27.14,42.38 27.3,42.54 C16.2 27.48,44.26 27.46,44.29 27.53,44.36 R24.1 27.53,45.32 arc45 26.59,45.72 25.02,45.72 arc-45 24.49,46.46 C70.+
N$36
  Top 0.305: C23.1 R24.2
N$37
  Top 0.305: IC4.7 24.6,38.89 arc-45 23.45,38.41 21.74,38.41 C24.1
N$38
  Top 0.305: SL3.1 25.87,53.97 arc-45 X1.4
N$39
  Top 0.254: IC1.65 52.71,13.7 arc90 54.34,12.06 arc-45 56.14,11.32
  Top 0.305: 56.14,11.32 58.15,9.31 arc45 59.94,8.57 68,8.57 arc26 74.77,10.16 arc21 81.11,14.92 arc120 TP4.1
N$40
  Top 0.254: IC1.66 53.21,13.96 arc90 54.48,12.7 54.66,12.7 arc-45 56.46,11.95
  Top 0.305: 56.46,11.95 58.46,9.95 arc45 60.26,9.2 67.68,9.2 arc62 TP3.1
N$41
  Top 0.254: IC1.67 53.71,14.33 arc90 54.71,13.33 54.98,13.33 arc-45 56.78,12.59
  Top 0.305: 56.78,12.59 58.78,10.58 arc45 60.58,9.84 67.36,9.84 arc53 78.26,15.24 arc75 78.26,17.46 arc-13 TP2.1
N$42
  Top 0.254: IC1.68 54.21,14.6 arc90 54.84,13.96 55.3,13.96 arc-45 57.09,13.22
  Top 0.305: 77.3,16.82 TP1.1 arc-61 67.04,10.47 60.9,10.47 arc-45 59.1,11.22 57.09,13.22
N$43
  Top 0.254: 59.21,16.28 arc90 IC1.73
  Top 0.305: 59.21,16.28 59.21,12.71 arc90 60.81,11.11 66.73,11.11 arc49 75.72,15.24 arc96 75.4,17.78 arc-57 TP5.1
N$44
  Top 0.254: 58.89,17.78 IC1.74
  Top 0.305: 58.89,17.78 arc-90 60.16,16.51 60.16,12.38 arc90 60.8,11.74 66.94,11.74 arc47 73.49,14.6 arc18 TP6.1
N$45
  Top 0.305: R23.1 R16.1 24.28,29.84 22.38,31.75 C14.1
N$46
  Top 0.254: IC1.20 36.2,25.28 arc-45 35.3,25.65 34.02,26.93 arc45 33.12,27.3 TP7.PP
N$47
  Top 0.254: TP8.PP 34.37,25.15 arc45 35.27,24.78 IC1.21
N$48
  Top 0.254: TP9.PP arc45 34.28,24.28 IC1.22
N$49
  Top 1.27: 4.92,45.08 L3.1 arc90 7.42,40 arc-22 13.81,38.73 C25.+ | 4.92,45.08 L2.2 | 4.92,45.08 C18.1
NCONFIG  (via drill 0.5)
  Top 0.254: 46.71,18.58 IC1.53 arc-12 46.51,13.33 arc-103 45.87,13.01 | 45.87,13.01 R9.1 | C26.1 45.87,13.01
  Top 0.305: 46.71,18.58 46.71,21.42 46.71,21.43 arc-38 50.95,30.16 56.03,35.24 arc-41 59.52,36.83 arc-8 v60.48,36.83
  Bottom 0.305: v60.48,36.83 67.25,36.83 arc45 68.15,37.2 SV2.5
NSTATUS  (via drill 0.5)
  Top 0.254: R15.1 49.37,13.33 arc-156 48.41,13.33 arc-12 IC1.56 arc-19 48.73,18.41
  Top 0.305: v62.06,35.55 58.36,35.55 arc45 56.56,34.81 53.66,31.91 arc47 49.37,20.95 arc-32 48.73,18.41
  Bottom 0.305: v62.06,35.55 68.73,35.55 arc50 SV2.9
RED
  Top 0.254: IC1.12 36.11,29.28 arc-45 34.76,29.84 arc-23 34.12,30.79
  Top 0.305: 47.78,45.4 R4.1 47.46,45.08 arc-32 44.92,43.81 arc38 34.76,38.09 arc30 33.81,36.19 arc30 34.12,30.79
REDPIN
  Top 0.305: X2.1 47.93,51.43 47.94,51.43 47.94,47.54 R4.2
SCK
  Top 0.254: R1.R2$2 39.44,12.93 39.52,13.01 39.52,13.38 arc-45 39.71,13.83 40.02,14.15 arc45 40.21,14.6 IC1.40
SOUND
  Top 0.254: 35.03,20.78 IC1.29
  Top 0.305: 24.44,25.88 25.55,23.81 arc60 29.68,21.27 32.58,21.27 32.6,21.27 arc-2 33.59,21.21 arc-27 34.43,20.95 arc31 35.03,20.78 | 24.44,25.88 R16.2 | TP11.1 25.23,22.54 arc27 24.44,25.88 | 24.44,25.88
VCC  (via drill 0.5)
  Top 0.254: 39.77,25.78 IC1.19 | 39.62,19.78 IC1.31 35.71,19.78 35.71,19.28 IC1.32 | 53.91,19.78 IC1.78 59.37,19.78 59.37,19.28 IC1.77 | v53.81,27.62 54.46,27.62 arc-53 56.48,26.62 arc53 57.16,26.28 IC1.91 | v53.81,30.48 54.55,31.54 arc-45 56.35,32.28 IC1.103 59.37,32.28 59.37,32.78 IC1.104 | v39.84,31.75 39.8,31.78 IC1.7 35.71,31.78 35.71,32.28 IC1.6 | 47.71,14.7 IC1.55 47.71,19.52 arc-45 v47.78,19.68 | R9.2 v47.46,12.06 R15.2 | 47.21,38.03 IC1.127 | 48.09,40.63 48.17,40.56
  Top 0.305: v39.84,25.71 39.77,25.78 | v39.84,19.68 39.62,19.78 | v53.81,19.68 53.91,19.78 | IC3.8 67.78,31.5 | QG2.1 65.98,13.86 65.88,13.96 67.56,15.66 C15.1 | QG2.1 66.04,13.5 66.19,13.65 | IC4.6 25.87,38.89 arc45 27.02,38.41 29.36,38.41 | 31.59,38.41 29.36,38.41 | v37.3,10.79 R21.1 | v30.95,14.6 R20.1 | v65.24,31.75 R17.2 | 47.14,40.63 46.61,40.63 arc18 44.6,40.32 arc10 v42.38,39.37 | 48.17,40.56 R28.2 | 47.14,40.63 48.09,40.63 48.34,40.63 arc-90 R27.2 | 29.36,38.41 C28.2 | 47.21,38.03 47.21,40.57 47.14,40.63 | v61.75,15.55 60.8,15.55 60.8,13.65 62.06,13.65 62.06,13.51 QG2.4 61.75,13.51 61.75,12.38 65.88,12.38 65.88,13.5 QG2.1
  Top 0.61: C22.1 10.02,25.85 arc45 11.11,25.39 12.54,25.39 arc90 13.65,26.51 13.56,26.59 R22.2 13.49,26.66 14.5,27.68 IC5.5 14.5,29.21 14.5,29.78 14.44,29.84 IC5.6 | R10.2 v65.24,31.75 arc65 63.65,26.66 arc28 65.24,23.81 arc17 68.41,21.27 TP16.1 arc37 70.64,18.09 C29.1
  Top 1.27: v65.24,31.75 IC3.8 | v27.78,24.12 v29.05,25.39 arc33 31.27,29.52 arc8 31.59,34.29 31.59,38.41 v31.59,39.37 31.61,40.89 arc-33 37.51,57.35 arc-14 38.5,58.4 v38.57,58.41 | 14.44,29.21 14.5,29.21 14.76,29.21 arc-19 18.57,26.35 arc46 v20.79,25.39 v22.06,25.39
  Bottom 0.254: v39.84,31.75 C1.1
  Bottom 0.305: v39.84,25.71 C6.1 | v39.84,19.68 C4.1 | v47.78,19.68 C2.1 | v53.81,19.68 C3.1 | v53.81,27.62 C5.1 | 53.81,32.38 53.81,32.7 C8.1 | 40.26,10.47 40.16,10.47 arc45 39.39,10.79 v37.3,10.79 | v42.38,39.37 C7.1
  Bottom 0.61: L1.1 51.66,10.4 51.59,10.47 | TP16.1 C30.+
  Bottom 1.27: 53.81,23.49 v53.81,19.68 v47.78,19.68 v39.84,19.68 v39.84,25.71 39.84,29.52 | 53.81,23.49 v53.81,27.62 53.81,29.21 | 53.81,29.21 v53.81,30.48 53.81,32.38 | 39.84,29.52 v39.84,31.75 39.84,39.37 | v27.78,24.12 arc90 40.47,12.06 v47.46,12.06 49.68,12.06 arc32 v61.75,15.55 | 53.81,29.21 65.24,29.21 v65.24,31.75 | SV1.4 arc90 77.94,60.32 73.26,60.32 arc5 v38.57,58.41 | v31.59,39.37 39.84,39.37 | 39.84,39.37 v42.38,39.37 | v27.78,24.12 27.78,22.27 arc45 v30.95,14.6 31.42,14.13 arc45 40.26,10.47 51.59,10.47 | v27.78,24.12 v29.05,25.39 v22.06,25.39 | v22.06,25.39 v20.79,25.39 v22.06,25.39 | 39.84,29.52 C13.+ | 53.81,23.49 C27.+
VSYNC
  Top 0.254: IC1.3 36,33.78 arc-80 35.4,34.29
  Top 0.305: 57.78,45.24 R8.1 57.62,45.08 arc-44 52.7,42.86 arc13 42.38,41.27 arc40 36.03,36.83 arc42 35.4,34.29
VSYNCPIN
  Top 0.305: X2.14 54.71,53.59 arc45 55.08,52.7 55.54,52.24 arc-45 55.87,51.43 arc33 57.78,47.3 R8.2

### Text on the board
Top: REV.B | (CC)ATTR3.0
201bmp: PGM | PGM | ROM | DIR | SVO 2007 | MAH PONK